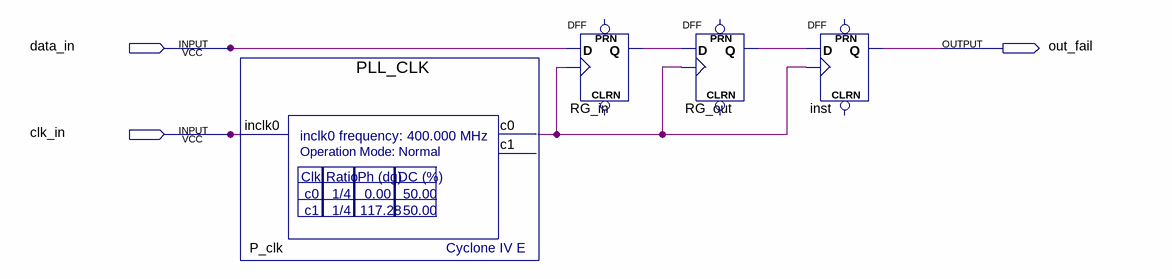
[diagram p0: schematic sheet]
// Quartus schematic Metastabil.bdf as structural Verilog: 4 symbols, 3 pins
module Metastabil (
  input  data_in,
  input  clk_in,
  output out_fail
);

  wire P_clk_c0, RG_in_q, RG_out_q;

  PLL_CLK P_clk (.inclk0(clk_in), .c0(P_clk_c0));  // open: c1
  DFF RG_in (.CLK(P_clk_c0), .D(data_in), .Q(RG_in_q));  // open: CLRN, PRN
  DFF RG_out (.CLK(P_clk_c0), .D(RG_in_q), .Q(RG_out_q));  // open: CLRN, PRN
  DFF inst (.CLK(P_clk_c0), .D(RG_out_q), .Q(out_fail));  // open: CLRN, PRN
endmodule
